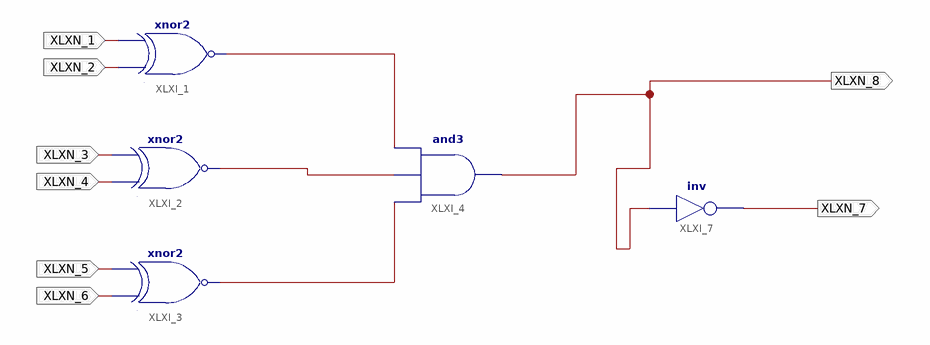
[diagram p0: schematic sheet 1]
// Xilinx ISE schematic lab5_2.sch (spartan6) as structural Verilog: 5 symbols, 8 ports
module lab5_2 (
  input  XLXN_1,
  input  XLXN_2,
  input  XLXN_3,
  input  XLXN_4,
  input  XLXN_5,
  input  XLXN_6,
  output XLXN_7,
  output XLXN_8
);

  wire XLXN_19, XLXN_20, XLXN_21;

  xnor XLXI_1 (XLXN_19, XLXN_2, XLXN_1);
  xnor XLXI_2 (XLXN_20, XLXN_4, XLXN_3);
  xnor XLXI_3 (XLXN_21, XLXN_6, XLXN_5);
  and XLXI_4 (XLXN_8, XLXN_21, XLXN_20, XLXN_19);
  not XLXI_7 (XLXN_7, XLXN_8);
endmodule
